# EAGLE board ESP32 Display 2.4 inch V1.2 (EAGLE 9.5.1)
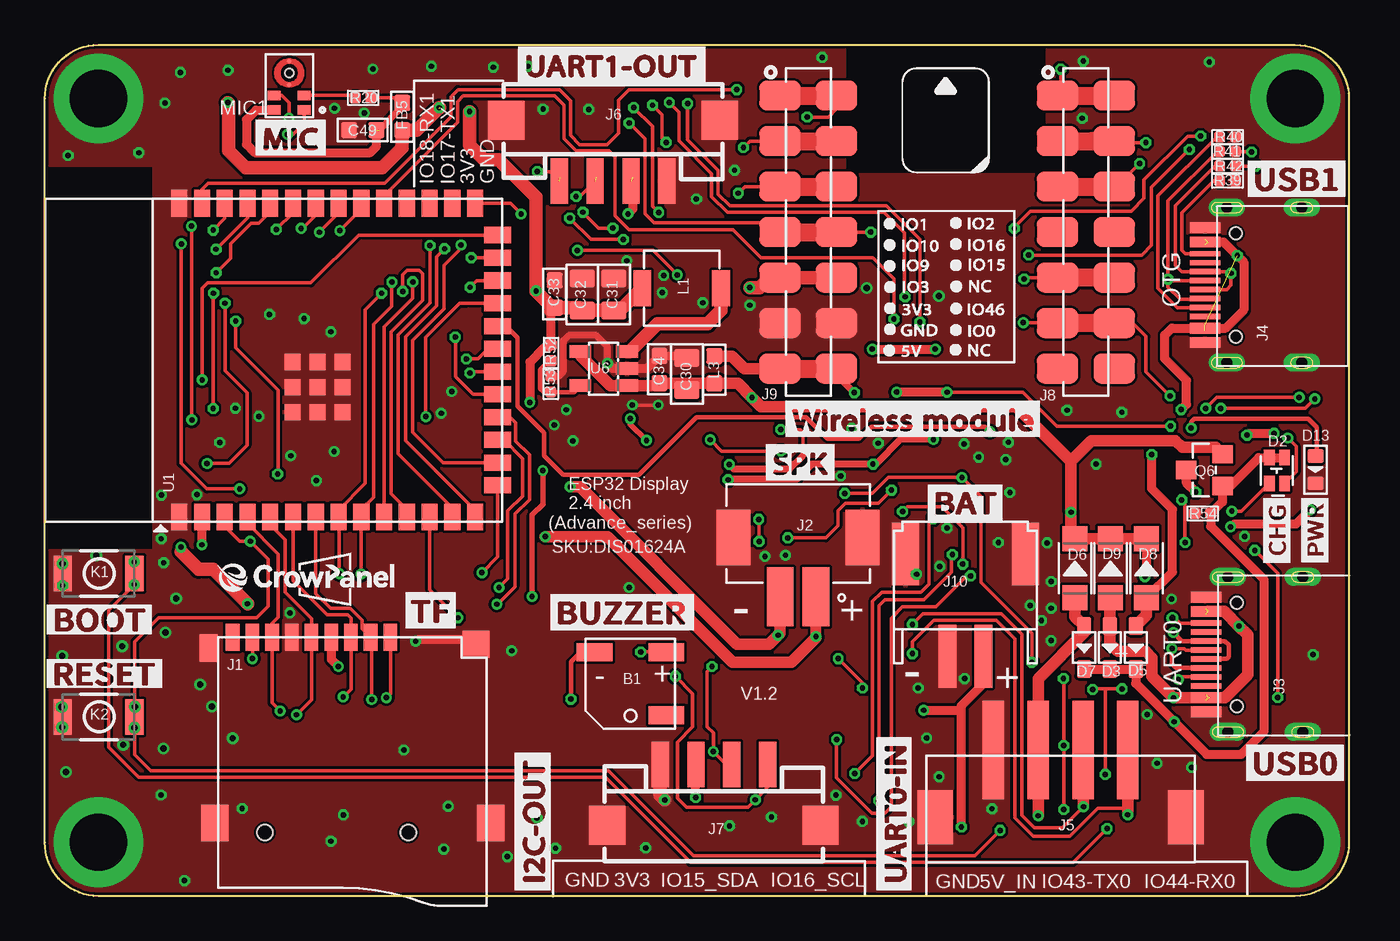
[diagram p5: board, top side]
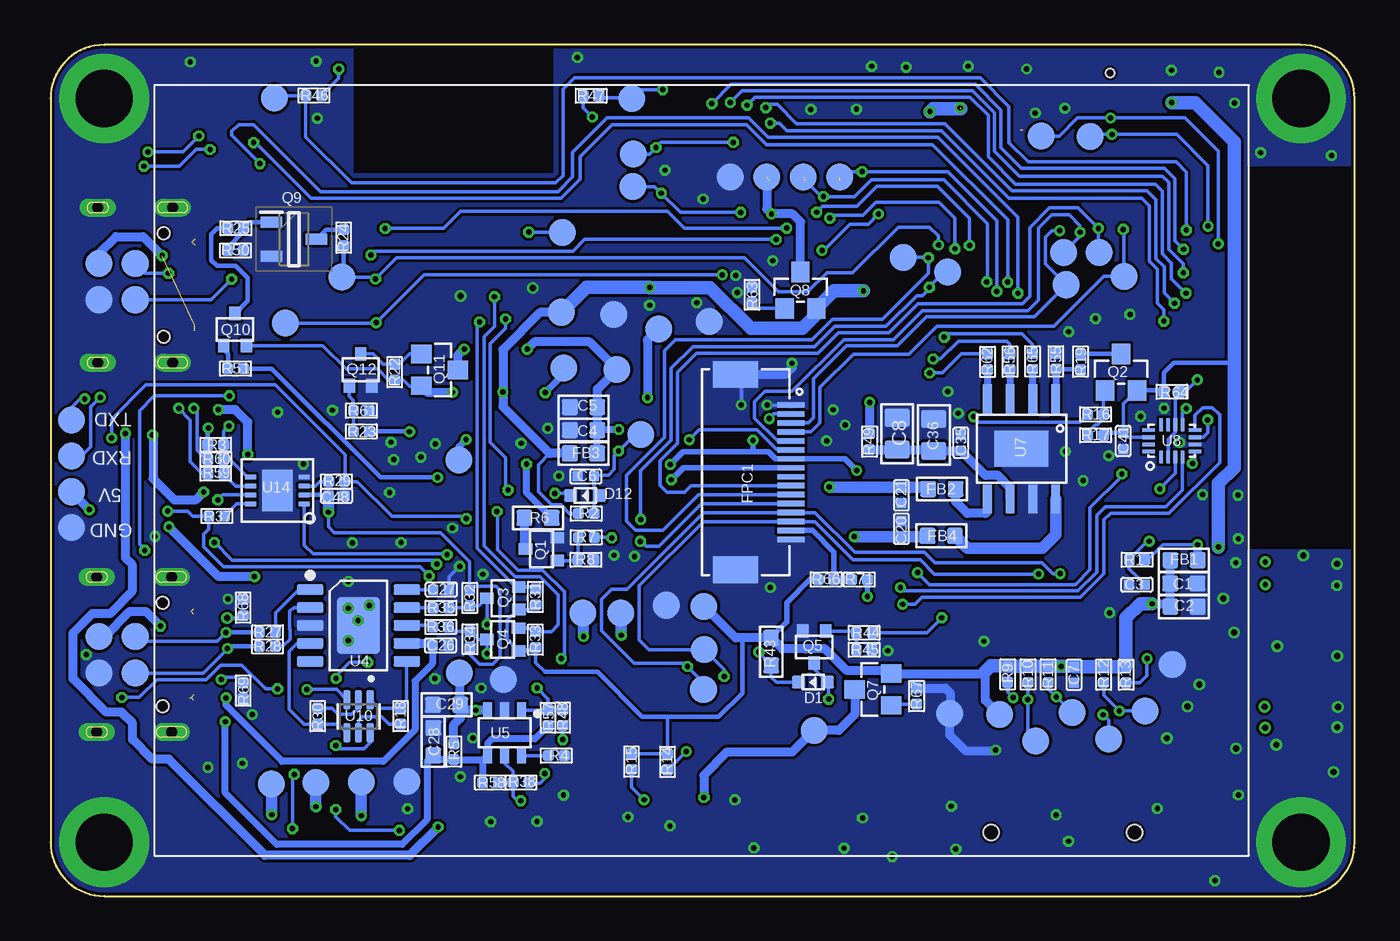
[diagram p6: board, bottom side, seen from below]

Size 72.8 x 47.5 mm. Coordinates in mm from the lower left corner, seen from the top.
Outline: 69.8,0 3,0 arc-90 0,3 0,44.5 arc-90 3,47.5 69.8,47.5 arc-90 72.8,44.5 72.8,3 arc-90 69.8,0
Copper layers (1*16): Top 0.035mm / dielectric 1.5mm / Bottom 0.035mm
Design rules "default": minimum track width 8mil, minimum drill 0.3mm, track to track 6mil, track to pad 6mil, pad to pad 4mil, via to via 6mil, smd to smd 6mil, copper to edge 6mil, drill to drill 4mil, minimum pad ring 6mil, minimum via ring 6mil, stop-mask expansion 4mil, vias tented up to drill 100mil, thermal gap 0mil
tRestrict: area 44.7,40.3 to 55.8,47.4; area 0,19.4 to 6,40.7
bRestrict: area 44.7,40.3 to 55.8,47.4; area 0,19.4 to 6,40.7

## Footprints (pad centres in the part's own frame; a part is rotated, then mirrored left to right if it is on the bottom)
BEEP_5025 = smd 2 x 1: 1 -2,-1.75; 2 2,-1.75; 3 -2,1.75
C0603 = smd 0.889 x 0.889: 1 -0.762,0; 2 0.762,0
C0402 = smd 0.6 x 0.6: 1 -0.45,0; 2 0.45,0
C0805 = smd 1.016 x 1.397: 1 -0.889,0; 2 0.889,0
D_SOD523 = smd 0.762 x 0.7: + -0.8,0; - 0.8,0
LED_KT-0603RYG = smd 0.85 x 0.6: 1 0.725,-0.425; 2 0.725,0.425; 3 -0.725,-0.425; 4 -0.725,0.425
D_SOD323 = smd 1 x 0.8: + -1.2,0; - 1.2,0
D_SOD123FL = smd 1.397 x 1.397: + -1.651,0; - 1.651,0
LED0603 = smd 0.762 x 0.889: + -0.762,0; - 0.762,0
L0603 = smd 0.889 x 0.889: 1 -0.762,0; 2 0.762,0
FPC-0.5MM-16P-SMD = smd 0.3 x 1.5: 1 -3.75,1.55; 2 -3.25,1.55; 3 -2.75,1.55; 4 -2.25,1.55; 5 -1.75,1.55; 6 -1.25,1.55; 7 -0.75,1.55; 8 -0.25,1.55; 9 0.25,1.55; 10 0.75,1.55; 11 1.25,1.55; 12 1.75,1.55; 13 2.25,1.55; 14 2.75,1.55; 15 3.25,1.55; 16 3.75,1.55 | smd 1.5 x 2.5: 17 5.45,-1.55; 18 -5.45,-1.55
9P-SMD-W/-RING = smd 1.524 x 0.762: 1 0,4.4; 2 0,3.3; 3 0,2.2; 4 0,1.1; 5 0,0; 6 0,-1.1; 7 0,-2.2; 8 0,-3.3; 9 0,-4.4 | smd 1.524 x 1.016: G1 0.6,-5.746 | smd 2.032 x 1.524: G2 10.373,-5.4; G3 10.373,10 | smd 1.524 x 1.524: G4 0.392,9.181 | hole 0.889: 10.9,-2.6; 10.9,5.4
CONN-TH_2P-P2.00_XUNPU_WAFER-PH2.0-2PLB = smd 1.5 x 3.3: 1 -1,1.65; 2 1,1.65 | smd 1.9 x 3.1: 3 3.6,-1.65; 4 -3.6,-1.65
USB-3.0TYPEC-SMD = smd 0.3 x 1.7: A1 -3.35,0.5; A4 -2.55,0.5; A5 -1.25,0.5; A6 -0.25,0.5; A7 0.25,0.5; A8 1.25,0.5; A9 2.55,0.5; A12 3.35,0.5; B1 3.05,0.5; B4 2.25,0.5; B5 1.75,0.5; B6 0.75,0.5; B7 -0.75,0.5; B8 -1.75,0.5; B9 -2.25,0.5; B12 -3.05,0.5 | drill 0.6 pad 1.016 long: P$1 -4.325,-0.72; P$2 4.325,-0.72; P$3 -4.325,-4.9; P$4 4.325,-4.9 | hole 0.68: -2.89,-1.22; 2.89,-1.22
XH2.54-4P-SMD = smd 1.2 x 5.5: 1 -3.75,-1.875; 2 -1.25,-1.875; 3 1.25,-1.875; 4 3.75,-1.875 | smd 2 x 3: 5 -7,1.875; 6 7,1.875
CONNECTOR_4P-SMD-2.0 = smd 0.965 x 2.54: 1 -3,0; 2 -1,0; 3 1,0; 4 3,0 | smd 2.032 x 2.184: SS1 -5.946,3.4; SS2 5.946,3.4
H7-2.54-18.28X2.5X5MM = smd 1.65 x 2.3: 1 -7.62,-1.58; 1-1 -7.62,1.58; 2 -5.08,-1.58; 2-2 -5.08,1.58; 3 -2.54,-1.58; 3-3 -2.54,1.58; 4 0,-1.58; 4-4 0,1.58; 5 2.54,-1.58; 5-5 2.54,1.58; 6 5.08,-1.58; 6-6 5.08,1.58; 7 7.62,-1.58; 7-7 7.62,1.58
PH2.0WT-2PIN = smd 1 x 3.5: P$1 -1,0; P$2 1,0 | smd 1.5 x 3.5: P$3 -3.35,-5.7; P$4 3.35,-5.7
TEST-PIN-4-2.0MM = smd 1.5 x 1.5: 1 -3,0; 2 -1,0; 3 1,0; 4 3,0
THO-M3.2*5MM-HOLE = drill 3.2 pad 5: P$1 0,0
157SW = smd 1.016 x 1.981: 1 0,0; 2 4,0
L0420 = smd 2 x 1: 1 0,2.2; 2 0,-2.2
MIC-SMD_5P-L3.5-W2.7-P1.67 = smd 0.725 x 0.522: 1 -0.838,1.362; 2 -0.838,0.542; 3 0.838,0.542; 4 0.838,1.362 | smd 0.25 x 0.25: 5_1 0,-0.048; 5_2 0,-1.373 | hole 0.5: 0,-0.71
TEST_PAD-1.5MM = smd 1.5 x 1.5: P$1 0,0
MOS_SOT323 = smd 0.635 x 0.762: 1 -0.635,-0.889; 2 0.635,-0.889; 3 0,0.889
PMOS_SOT23 = smd 1.016 x 1.143: 1 -0.889,-1.016; 2 0.889,-1.016; 3 0,1.016
SOT95P280X125-3N = smd 1.2 x 0.6: 1 -1.25,0.95; 2 -1.25,-0.95; 3 1.25,0
R0402 = smd 0.635 x 0.635: 1 -0.445,0; 2 0.445,0
R0603-SP = smd 0.889 x 0.889: 1 -0.762,0; 2 0.762,0
ESP32-S3-WROOM-1-SMD41 = smd 1.5 x 0.9: 1 -8.75,5.26; 2 -8.75,3.99; 3 -8.75,2.72; 4 -8.75,1.45; 5 -8.75,0.18; 6 -8.75,-1.09; 7 -8.75,-2.36; 8 -8.75,-3.63; 9 -8.75,-4.9; 10 -8.75,-6.17; 11 -8.75,-7.44; 12 -8.75,-8.71; 13 -8.75,-9.98; 14 -8.75,-11.25; 27 8.75,-11.25; 28 8.75,-9.98; 29 8.75,-8.71; 30 8.75,-7.44; 31 8.75,-6.17; 32 8.75,-4.9; 33 8.75,-3.63; 34 8.75,-2.36; 35 8.75,-1.09; 36 8.75,0.18; 37 8.75,1.45; 38 8.75,2.72; 39 8.75,3.99; 40 8.75,5.26 | smd 0.9 x 1.5: 15 -6.985,-12.5; 16 -5.715,-12.5; 17 -4.445,-12.5; 18 -3.175,-12.5; 19 -1.905,-12.5; 20 -0.635,-12.5; 21 0.635,-12.5; 22 1.905,-12.5; 23 3.175,-12.5; 24 4.445,-12.5; 25 5.715,-12.5; 26 6.985,-12.5 | smd 0.9 x 0.9: 41 -2.9,-1.06; 42 -1.5,-1.06; 43 -0.1,-1.06; 44 -2.9,-2.46; 45 -1.5,-2.46; 46 -0.1,-2.46; 47 -2.9,-3.86; 48 -1.5,-3.86; 49 -0.1,-3.86
ESOP-10-EP-150MIL = smd 1.5 x 0.6: 1 -2.7,2; 2 -2.7,1; 3 -2.7,0; 4 -2.7,-1; 5 -2.7,-2; 6 2.7,-2; 7 2.7,-1; 8 2.7,0; 9 2.7,1; 10 2.7,2 | smd 2.4 x 3.2: EP 0,0
SOT23-6L = smd 0.5 x 0.9: 1 -0.961,-1.212; 2 -0.011,-1.212; 3 0.94,-1.212; 4 0.94,1.288; 5 -0.011,1.288; 6 -0.961,1.288
IC_SOT23-5 = smd 0.69 x 1.2: 1 -0.95,-1.3; 2 0,-1.3; 3 0.95,-1.3; 4 0.95,1.3; 5 -0.95,1.3
NS4168-ESOP-8 = smd 1.6 x 0.5: 1 -2.8,1.905; 2 -2.8,0.635; 3 -2.8,-0.635; 4 -2.8,-1.905; 5 2.8,-1.905; 6 2.8,-0.635; 7 2.8,0.635; 8 2.8,1.905 | smd 2 x 3: 9 0,0
IC_SGM3799_TQFN2.6X1.8_16L = smd 0.2 x 0.7: 1 -0.6,-0.9; 2 -0.2,-0.9; 3 0.2,-0.9; 4 0.6,-0.9; 9 0.6,0.9; 10 0.2,0.9; 11 -0.2,0.9; 12 -0.6,0.9 | smd 0.7 x 0.2: 5 1.3,-0.6; 6 1.3,-0.2; 7 1.3,0.2; 8 1.3,0.6; 13 -1.3,0.6; 14 -1.3,0.2; 15 -1.3,-0.2; 16 -1.3,-0.6
SOP65P210X100-6N = smd 1.09 x 0.4: 1 -0.92,0.65; 2 -0.92,0; 3 -0.92,-0.65; 4 0.92,-0.65; 5 0.92,0; 6 0.92,0.65
DFN8 = smd 0.61 x 0.25: 1 -1.5,0.75; 2 -1.5,0.25; 3 -1.5,-0.25; 4 -1.5,-0.75; 5 1.5,-0.75; 6 1.5,-0.25; 7 1.5,0.25; 8 1.5,0.75 | smd 1.7 x 2.3: P$9 0,0

## Placement (x,y rotation side)
B1  BEEP_5025  [BEEP_5025]  32.69,11.85 180 top
C1  10uF/0603  [C0603]  9.54,17.44 180 bottom
C2  100nF/0603  [C0603]  9.53,16.15 180 bottom
C3  1uF  [C0402]  12.16,17.37 0 bottom
C4  100nF/0603  [C0603]  43.04,26 0 bottom
C5  100nF/0603  [C0603]  43.04,27.28 0 bottom
C6  1uF  [C0402]  42.92,23.42 0 bottom
C7  1uF  [C0402]  15.67,12.35 90 bottom
C8  47uF/0805  [C0805]  25.54,25.8 90 bottom
C20  1nF  [C0402]  25.3,20.49 270 bottom
C21  1nF  [C0402]  25.3,22.36 90 bottom
C26  1uF  [C0402]  51.03,13.98 180 bottom
C27  1uF  [C0402]  50.99,17.1 180 bottom
C28  1uF/0603  [C0603]  51.44,8.62 270 bottom
C29  10uF/0603/NC  [C0603]  50.69,10.67 0 bottom
C30  22uF/0805  [C0805]  35.84,29.13 270 top
C31  22uF/0805  [C0805]  31.77,33.56 270 top
C32  22uF/0805  [C0805]  30,33.56 270 top
C33  1uF/0603  [C0603]  28.46,33.59 270 top
C34  1uF/0603  [C0603]  34.31,29.39 270 top
C35  100nF  [C0402]  21.99,25.3 90 bottom
C36  47uF/0805  [C0805]  23.49,25.73 90 bottom
C41  1uF  [C0402]  12.93,25.39 90 bottom
C48  1uF  [C0402]  56.83,22.33 180 bottom
C49  100nF/0603  [C0603]  17.75,42.74 0 top
D1  B5819WT  [D_SOD523]  30.24,11.94 180 bottom
D2  KT-0603RYG  [LED_KT-0603RYG]  68.77,23.75 90 top
D3  1N5817WS  [D_SOD323]  59.45,13.87 270 top
D5  1N5817WS  [D_SOD323]  60.9,13.87 270 top
D6  DSS34  [D_SOD123FL]  57.51,18.29 90 top
D7  1N5817WS  [D_SOD323]  58.02,13.87 270 top
D8  DSS34  [D_SOD123FL]  61.5,18.29 90 top
D9  DSS34  [D_SOD123FL]  59.49,18.29 90 top
D12  B5819WT  [D_SOD523]  42.96,22.35 180 bottom
D13  Red  [LED0603]  70.93,23.8 270 top
FB1  0R/800mA  [L0603]  9.53,18.74 0 bottom
FB2  1K/500mA  [L0603]  23.04,22.71 180 bottom
FB3  0R/800mA  [L0603]  43.05,24.7 0 bottom
FB4  1K/500mA  [L0603]  23.08,20.1 180 bottom
FB5  0R/800mA  [L0603]  19.95,43.49 90 top
FPC1  TFT-2.4-SPI-16P  [FPC-0.5MM-16P-SMD]  33.01,23.65 270 bottom
J1  [9P-SMD-W/-RING]  14.89,14.44 270 top
J2  WAFER-PH2.0-2PLB  [CONN-TH_2P-P2.00_XUNPU_WAFER-PH2.0-2PLB]  42.05,18.36 180 top
J3  TYPEC-3.0-16P-SMD  [USB-3.0TYPEC-SMD]  65.32,13.48 90 top
J4  TYPEC-3.0-16P-SMD  [USB-3.0TYPEC-SMD]  65.26,34.09 90 top
J5  XH2.54-4P-SMT  [XH2.54-4P-SMD]  56.7,6.28 180 top
J6  HY2.0-4P-SMT  [CONNECTOR_4P-SMD-2.0]  31.72,39.89 0 top
J7  HY2.0-4P-SMT  [CONNECTOR_4P-SMD-2.0]  37.35,7.35 180 top
J8  [H7-2.54-18.28X2.5X5MM]  58.11,37.05 270 top
J9  [H7-2.54-18.28X2.5X5MM]  42.62,37.05 270 top
J10  PH2.0WT-2PIN  [PH2.0WT-2PIN]  51.39,13.38 180 top
J11  HC-PZ200-8.7L-1X4PZ1  [TEST-PIN-4-2.0MM]  71.62,23.56 270 bottom
J12  THO-M3.25MM-HOLE  [THO-M3.2*5MM-HOLE]  3,3 0 top
J13  THO-M3.25MM-HOLE  [THO-M3.2*5MM-HOLE]  69.8,3 0 top
J14  THO-M3.25MM-HOLE  [THO-M3.2*5MM-HOLE]  69.8,44.5 0 top
J15  THO-M3.25MM-HOLE  [THO-M3.2*5MM-HOLE]  3,44.5 0 top
K1  BUTTON  [157SW]  1,18 0 top
K2  BUTTON  [157SW]  1,10 0 top
L1  4.7uH/3A  [L0420]  35.55,33.92 270 top
L3  NC  [L0603]  37.37,29.37 270 top
MIC1  LMD3526B261-OFA01  [MIC-SMD_5P-L3.5-W2.7-P1.67]  13.65,45.22 180 top
P1  TEST_PADPAD-1.5MM  [TEST_PAD-1.5MM]  36.33,16.16 180 bottom
P2  TEST_PADPAD-1.5MM  [TEST_PAD-1.5MM]  36.35,11.51 0 bottom
P3  TEST_PADPAD-1.5MM  [TEST_PAD-1.5MM]  36.31,13.75 0 bottom
P4  TEST_PADPAD-1.5MM  [TEST_PAD-1.5MM]  22.71,34.82 0 bottom
P5  TEST_PADPAD-1.5MM  [TEST_PAD-1.5MM]  25.2,35.64 0 bottom
P6  TEST_PADPAD-1.5MM  [TEST_PAD-1.5MM]  38.43,16.23 180 bottom
P7  TEST_PADPAD-1.5MM  [TEST_PAD-1.5MM]  41.18,29.39 0 bottom
P8  TEST_PADPAD-1.5MM  [TEST_PAD-1.5MM]  39.86,25.75 0 bottom
P9  TEST_PADPAD-1.5MM  [TEST_PAD-1.5MM]  12.88,34.58 180 bottom
P10  TEST_PADPAD-1.5MM  [TEST_PAD-1.5MM]  14.26,35.91 0 bottom
P11  TEST_PADPAD-1.5MM  [TEST_PAD-1.5MM]  16.25,35.9 0 bottom
P12  TEST_PADPAD-1.5MM  [TEST_PAD-1.5MM]  16.1,34.11 0 bottom
P13  TEST_PADPAD-1.5MM  [TEST_PAD-1.5MM]  44.24,37.03 0 bottom
P14  TEST_PADPAD-1.5MM  [TEST_PAD-1.5MM]  40.3,39.59 0 bottom
P15  TEST_PADPAD-1.5MM  [TEST_PAD-1.5MM]  50,24.32 0 bottom
P16  TEST_PADPAD-1.5MM  [TEST_PAD-1.5MM]  30.18,9.25 0 bottom
P17  TEST_PADPAD-1.5MM  [TEST_PAD-1.5MM]  19.83,10.14 0 bottom
P18  TEST_PADPAD-1.5MM  [TEST_PAD-1.5MM]  40.97,15.8 0 bottom
P19  TEST_PADPAD-1.5MM  [TEST_PAD-1.5MM]  17.8,8.66 0 bottom
P20  TEST_PADPAD-1.5MM  [TEST_PAD-1.5MM]  15.77,10.23 0 bottom
P21  TEST_PADPAD-1.5MM  [TEST_PAD-1.5MM]  13.74,8.76 0 bottom
P22  TEST_PADPAD-1.5MM  [TEST_PAD-1.5MM]  11.7,10.33 0 bottom
P23  TEST_PADPAD-1.5MM  [TEST_PAD-1.5MM]  40.28,41.39 0 bottom
P24  TEST_PADPAD-1.5MM  [TEST_PAD-1.5MM]  10.18,12.92 0 bottom
P26  TEST_PADPAD-1.5MM  [TEST_PAD-1.5MM]  14.78,42.37 0 bottom
P27  TEST_PADPAD-1.5MM  [TEST_PAD-1.5MM]  17.52,42.4 0 bottom
P28  TEST_PADPAD-1.5MM  [TEST_PAD-1.5MM]  22.61,10.18 90 bottom
P30  TEST_PADPAD-1.5MM  [TEST_PAD-1.5MM]  43.1,15.79 0 bottom
P31  TEST_PADPAD-1.5MM  [TEST_PAD-1.5MM]  59.69,31.97 180 bottom
P32  TEST_PADPAD-1.5MM  [TEST_PAD-1.5MM]  56.53,34.54 180 bottom
P36  TEST_PADPAD-1.5MM  [TEST_PAD-1.5MM]  32.81,40.11 0 bottom
P37  TEST_PADPAD-1.5MM  [TEST_PAD-1.5MM]  34.85,40.11 0 bottom
P38  TEST_PADPAD-1.5MM  [TEST_PAD-1.5MM]  30.78,40.11 0 bottom
P39  TEST_PADPAD-1.5MM  [TEST_PAD-1.5MM]  28.75,40.11 0 bottom
P40  TEST_PADPAD-1.5MM  [TEST_PAD-1.5MM]  55.45,6.36 0 bottom
P41  TEST_PADPAD-1.5MM  [TEST_PAD-1.5MM]  52.91,6.39 0 bottom
P42  TEST_PADPAD-1.5MM  [TEST_PAD-1.5MM]  57.99,6.33 0 bottom
P43  TEST_PADPAD-1.5MM  [TEST_PAD-1.5MM]  60.47,6.26 0 bottom
P44  TEST_PADPAD-1.5MM  [TEST_PAD-1.5MM]  70.1,35.31 0 bottom
P45  TEST_PADPAD-1.5MM  [TEST_PAD-1.5MM]  68.07,33.27 0 bottom
P46  TEST_PADPAD-1.5MM  [TEST_PAD-1.5MM]  68.07,35.31 0 bottom
P47  TEST_PADPAD-1.5MM  [TEST_PAD-1.5MM]  70.1,33.27 0 bottom
P48  TEST_PADPAD-1.5MM  [TEST_PAD-1.5MM]  70.1,14.48 0 bottom
P49  TEST_PADPAD-1.5MM  [TEST_PAD-1.5MM]  68.07,14.48 0 bottom
P50  TEST_PADPAD-1.5MM  [TEST_PAD-1.5MM]  68.07,12.45 0 bottom
P51  TEST_PADPAD-1.5MM  [TEST_PAD-1.5MM]  70.1,12.45 0 bottom
P52  TEST_PADPAD-1.5MM  [TEST_PAD-1.5MM]  49.99,12.46 0 bottom
P53  TEST_PADPAD-1.5MM  [TEST_PAD-1.5MM]  47.52,12.09 0 bottom
P54  TEST_PADPAD-1.5MM  [TEST_PAD-1.5MM]  38.86,31.65 270 bottom
P55  TEST_PADPAD-1.5MM  [TEST_PAD-1.5MM]  36.04,32.07 270 bottom
P58  TEST_PADPAD-1.5MM  [TEST_PAD-1.5MM]  60.31,44.53 0 bottom
P59  TEST_PADPAD-1.5MM  [TEST_PAD-1.5MM]  40.34,44.5 0 bottom
P60  TEST_PADPAD-1.5MM  [TEST_PAD-1.5MM]  41.36,32.46 0 bottom
P61  TEST_PADPAD-1.5MM  [TEST_PAD-1.5MM]  44.28,32.58 0 bottom
P62  TEST_PADPAD-1.5MM  [TEST_PAD-1.5MM]  44.16,29.47 0 bottom
Q1  SS8050W-SOT323  [MOS_SOT323]  45.39,19.36 90 bottom
Q2  AO3401  [PMOS_SOT23]  13.04,29.23 0 bottom
Q3  BSS138W_SOT323  [MOS_SOT323]  47.55,16.62 90 bottom
Q4  BSS138W_SOT323  [MOS_SOT323]  47.56,14.31 90 bottom
Q5  SS8050W-SOT323  [MOS_SOT323]  30.17,13.9 180 bottom
Q6  AO3401  [PMOS_SOT23]  64.72,23.77 90 top
Q7  AO3401  [PMOS_SOT23]  26.89,11.53 90 bottom
Q8  AO3401  [PMOS_SOT23]  30.93,33.81 0 bottom
Q9  AO3400  [SOT95P280X125-3N]  59.21,36.65 0 bottom
Q10  SS8550W-SOT323  [MOS_SOT323]  62.5,31.61 0 bottom
Q11  AO3401/NC  [PMOS_SOT23]  51.08,29.36 270 bottom
Q12  SS8050W-SOT323/NC  [MOS_SOT323]  55.49,29.36 0 bottom
R1  10K  [R0402]  12.15,18.76 0 bottom
R2  10K  [R0402]  42.9,21.34 180 bottom
R3  5.1K  [R0402]  63.58,25.18 0 bottom
R4  2K  [R0402]  44.57,7.84 180 bottom
R5  5.1K  [R0402]  50.29,8.06 270 bottom
R6  8.2R/0603  [R0603-SP]  45.58,21.1 0 bottom
R7  1K  [R0402]  42.9,20.01 0 bottom
R8  47K  [R0402]  42.92,18.77 0 bottom
R9  10K  [R0402]  19.37,12.37 90 bottom
R10  10K  [R0402]  18.23,12.37 90 bottom
R11  10K  [R0402]  17.11,12.37 90 bottom
R12  10K  [R0402]  14.01,12.36 90 bottom
R13  10K  [R0402]  12.76,12.35 90 bottom
R14  4.7k  [R0402]  38.36,7.49 90 bottom
R15  4.7k  [R0402]  40.37,7.5 90 bottom
R16  100R  [R0402]  14.47,26.88 0 bottom
R17  10K  [R0402]  14.47,25.71 0 bottom
R18  10K  [R0402]  53.26,10.04 90 bottom
R19  1K  [R0402]  15.31,29.82 270 bottom
R20  10K/NC  [R0402]  17.77,44.54 0 top
R22  100K/NC  [R0402]  53.59,29.23 270 bottom
R23  1K/NC  [R0402]  55.45,25.93 0 bottom
R24  100R  [R0402]  56.44,36.75 270 bottom
R25  100R  [R0402]  62.46,37.27 180 bottom
R27  0R  [R0402]  60.69,14.72 180 bottom
R28  0R  [R0402]  60.69,13.93 180 bottom
R29  2K  [R0402]  56.83,23.13 0 bottom
R30  10K  [R0402]  57.89,10.04 270 bottom
R31  4.7k  [R0402]  45.73,16.69 270 bottom
R32  4.7k  [R0402]  49.4,16.64 90 bottom
R33  4.7k  [R0402]  45.73,14.31 270 bottom
R34  4.7k  [R0402]  49.38,14.33 270 bottom
R35  0R  [R0402]  51,16.08 180 bottom
R36  0R  [R0402]  51.02,15.02 180 bottom
R37  5.1K  [R0402]  63.52,21.21 180 bottom
R38  NC  [R0402]  46.54,6.33 0 bottom
R39  5.1K  [R0402]  66.02,39.91 180 top
R40  5.1K  [R0402]  66.02,42.35 180 top
R41  0R  [R0402]  66.02,41.54 180 top
R42  0R  [R0402]  66.02,40.73 180 top
R43  3.9R/0603  [R0603-SP]  32.57,13.64 90 bottom
R44  1K  [R0402]  27.38,14.69 0 bottom
R45  47K  [R0402]  27.39,13.74 0 bottom
R46  0R  [R0402]  58.11,44.67 180 bottom
R47  0R  [R0402]  42.62,44.66 0 bottom
R48  NC  [R0402]  44.22,9.96 270 bottom
R49  0R  [R0402]  27.08,25.36 270 bottom
R50  10K  [R0402]  62.47,36.02 0 bottom
R51  10K  [R0402]  62.47,29.43 180 bottom
R52  45.3K  [R0402]  28.26,30.31 90 top
R53  10K  [R0402]  28.25,28.57 270 top
R54  10K  [R0402]  64.64,21.35 0 top
R55  100K  [R0402]  16.68,29.84 90 bottom
R56  0R  [R0402]  19.24,29.82 90 bottom
R57  5.1K  [R0402]  45.02,9.95 90 bottom
R58  5.1K  [R0402]  48.25,6.33 0 bottom
R59  0R  [R0402]  63.58,23.57 0 bottom
R60  0R  [R0402]  63.58,24.38 0 bottom
R61  47K/NC  [R0402]  55.45,27.09 0 bottom
R62  0R  [R0402]  20.49,29.81 90 bottom
R63  10K  [R0402]  33.64,33.55 270 bottom
R64  10K/NC  [R0402]  10.21,28.14 180 bottom
R65  0R  [R0402]  17.98,29.83 90 bottom
R66  0R/NC  [R0402]  29.51,17.67 180 bottom
R67  10K  [R0402]  24.46,11.16 270 bottom
R68  5.1K  [R0402]  62.05,16.1 270 bottom
R69  5.1K  [R0402]  62.05,11.46 270 bottom
R71  0R  [R0402]  27.65,17.66 0 bottom
U1  ESP32-S3-WROOM-1  [ESP32-S3-WROOM-1-SMD41]  12.77,29.9 90 top
U4  CH340K  [ESOP-10-EP-150MIL]  55.61,15.1 0 bottom
U5  TP4059-SOT23-6  [SOT23-6L]  47.45,9.15 180 bottom
U6  RY3420  [IC_SOT23-5]  31.2,29.43 90 top
U7  NS4168-ESOP-8  [NS4168-ESOP-8]  18.6,24.95 270 bottom
U8  SGM3799  [IC_SGM3799_TQFN2.6X1.8_16L]  10.21,25.4 0 bottom
U10  UMH3NTN  [SOP65P210X100-6N]  55.61,10.03 270 bottom
U14  STC8G1K08A  [DFN8]  60.14,22.63 180 bottom

## Tracks (layer width: path | path; a pad name or v marks a point on that pad's centre or on a via)
3V3  (via drill 0.3)  (1 unrouted)
  Top 0.203: v62.84,26.22 56.49,26.22 54.6,28.11 v50.36,28.11
  Top 0.508: 31.77,32.66 C31.2 | J1.4 15.99,13.21 v16.39,12.81 | 7.6,19.22 v7.6,19.47 | 28.26,32.63 R52.2 28.09,30.59 27.87,30.59 27.08,29.8 v27.08,27.55 | v50.36,28.11 v47.56,28.11 v47.55,28.12
  Top 0.762: 28.26,32.63 C33.2 | C33.2 29.84,32.83 C32.2 C31.2 32.11,32.68 L1.2 | C33.2 28.34,32.83 27.43,33.74 27.43,33.85 | 27.43,34 27.43,33.85 | 27.43,33.85 27.42,33.84 | v27.42,33.77 27.42,33.84 | v39.35,33.96 39.91,33.96 40.46,34.51 J9.5 J9.5-5 | v11.32,16.31 9.4,18.23 8.59,18.23 7.6,19.22 | 27.42,33.84 27.42,38.99 25.33,41.08 24.52,41.08 23.71,41.89 v23.71,43.77 | v10.22,44.28 10.27,44.23 10.27,41.58 11.22,40.63 18.84,40.63 19.95,41.74 FB5.1 20.75,42.73 22,43.98 v22.02,43.98
  Bottom 0.203: 45.2,12.5 45.73,13.03 R33.2 | Q4.1 47.32,14.32 47.32,15.38 46.72,15.98 Q3.1 45.99,15.98 R31.2 | 40.39,7.96 R15.2 R14.2 38.36,10 38.35,10.01 | U8.14 12.68,25.6 C41.2 12.93,27.47 12.18,28.22 Q2.2 | R2.2 43.82,21.34 44.31,21.83 44.84,21.83 45.57,22.56 45.57,24.07 44.94,24.7 | R3.2 63.14,25.92 v62.84,26.22 | R64.2 10.58,28.21 | Q11.2 52.12,28.45 52.75,28.45 53.09,28.79 R22.2 53.93,28.79 54.55,29.41 56.31,29.41 57.62,30.72 Q10.2
  Bottom 0.254: 45.2,12.5 42.26,12.5 39.77,10.01 38.35,10.01 35.5,10.01 34.18,11.33 34.18,14.4 | R33.2 45.92,13.68 Q4.1 | R17.2 13.89,25.84 C41.2 | 12.18,28.22 10.73,28.22 R64.2 10.65,29.19 10.09,29.75 6.73,29.75
  Bottom 0.305: R66.2 30.4,17.67 31.69,16.38 31.69,15.31 32.57,14.43 R43.2
  Bottom 0.508: P17.P$1 20.62,10.92 20.62,12.47 | 19.41,12.86 R9.2 | 20.62,12.47 20.62,12.55 | R10.2 | C7.2 | R12.2 | R13.2 | FB1.1 C1.2 C2.2 10.45,16.31 v11.32,16.31 | 20.62,12.47 20.67,12.42 Q7.2 26.04,12.58 28.34,12.58 29.56,13.8 30.66,13.8 30.67,13.79 31.95,13.79 R43.2 34.18,14.4 34.56,14.4 P1.P$1 | FB3.1 44.94,24.7 47.55,27.31 v47.55,28.12 47.55,30.49 45.46,32.58 P61.P$1 | 6.74,30.45 6.73,30.46 | v27.08,27.55 R49.1 | Q11.2 51.74,28.11 v50.36,28.11
  Bottom 0.762: v27.42,33.77 29.07,33.77 Q8.2 30.04,32.47 30.84,31.67 33.69,31.67 35.98,33.96 v39.35,33.96 39.36,33.97 42.89,33.97 P61.P$1 | 20.62,12.55 20.31,12.86 19.41,12.86 R9.2 R10.2 R11.2 v16.39,12.81 C7.2 | C7.2 R12.2 | R12.2 R13.2 | R13.2 12.76,15.52 11.97,16.31 v11.32,16.31 | v7.6,19.47 7.6,23.04 6.73,23.91 6.73,29.75 6.73,30.46 6.73,42.1 8.91,44.28 v10.22,44.28 | v23.71,43.77 23.55,43.93 21.97,43.93
3V3_1  (1 unrouted)
  Top 0.203: R20.2 19.46,44.54 19.95,44.05
  Top 0.381: 18.65,42.74 19.95,44.05 FB5.2 20.14,44.45
  Top 0.5: 11.77,43.83 11.8,43.86 MIC1.4
  Top 0.508: 11.77,43.83 11.26,43.32 11.26,41.95 11.72,41.49 18.16,41.49 18.51,41.84 C49.2
3V3_OUT1  (via drill 0.3)  (1 unrouted)
  Top 0.508: v32.55,38.06 32.83,38.34 32.83,40.44
  Bottom 0.508: P36.P$1 32.81,38.32 v32.55,38.06 31.39,38.06 30.93,37.61 Q8.3
3V3_OUT2  (via drill 0.3)
  Top 0.508: v36.33,5.51 36.33,7.33 J7.3
  Bottom 0.508: v36.33,5.51 36.33,6.74 35.03,8.04 31.39,8.04 P16.P$1 28.8,9.25 27.91,10.14 Q7.3
+5V_IN  (via drill 0.3)
  Top 0.635: D6.+ 57.51,15.58 D7.+ 58.02,14.71 55.45,12.14 J5.3 v55.45,4.48
  Bottom 0.635: v55.45,4.48 P40.P$1
+VBUS1  (via drill 0.3)  (5 unrouted)
  Top 0.635: D9.+ 59.45,16.59 D3.+ 59.45,14.09 59.89,13.65 61.45,13.65 61.79,13.31 61.79,12.27 v63,11.06 65.04,11.06 | 64.94,15.88 65.84,15.88 v66.66,15.06 67.14,14.58 67.14,12.34 65.86,11.06 64.95,11.06
  Bottom 0.381: C26.2 51.48,12.97 52.45,12 52.45,9.29 54.22,7.52 59.87,7.52 63,10.65 v63,11.06
  Bottom 0.508: U4.7 51.6,14.1 C26.2 | P48.P$1 69.78,14.48 68.37,15.89 67.49,15.89 v66.66,15.06
+VBUS2  (via drill 0.3)  (4 unrouted)
  Top 0.508: 64.91,36.49 65.81,36.49 v66.56,35.73 66.92,35.38 66.92,32.69 65.92,31.7 62.92,31.7 62.52,31.3 62.52,29.99 63.73,28.78 63.73,27.44 v63.43,27.14 | D8.+ 62.94,18.07 62.94,21.58 61.79,22.73 v61.79,24.63
  Top 0.635: D5.+ 61.5,15.67 D8.+
  Bottom 0.508: P44.P$1 70.1,35.84 69.14,36.8 67.63,36.8 v66.56,35.73 | v61.79,24.63 61.79,26.44 62.49,27.14 v63.43,27.14
+VC_IN  (via drill 0.3)
  Top 0.508: D7.- D3.- D5.- 60.9,11.87 v63.05,9.72 64.86,7.91 66.78,7.91 68.07,9.2 68.07,17.64 65.08,20.62 R54.2 65.73,22 65.73,22.8 65.74,22.79 Q6.1 66.17,22.88 67.76,24.47 D2.2 D2.1
  Bottom 0.381: U5.4 48.69,7.57 R58.1 | U5.4 48.65,7.61 R5.2 51.2,7.61 C28.2 51.79,7.51 51.79,4.26 53.16,2.89 60.18,2.89 63.05,5.75 v63.05,9.72 | R57.1 45.76,8.77 48.16,8.77 48.39,8.54 U5.4
C_LED
  Bottom 0.203: U14.8 62.4,21.88 R37.1
CH_EN  (via drill 0.3, 0.35)
  Top 0.203: U1.3 10.05,20.63 10.88,19.8 v11.47,19.8 12.47,18.8 12.47,16.18 11.83,15.54 6.37,15.54 5.03,14.2 5.03,10.59 v5.04,10.57 5,10.53 K2.2 v5.01,9.39 | v55.1,13.04 55.1,14.66 52.25,17.51 52.25,22.31 v51.2,23.36 47.08,23.36 46.19,22.47 v44.65,22.47 | v56.88,8.4 56.88,8.57 | 56.88,8.57 56.88,12.12 v56.86,12.14 | v53.33,3.67 51.92,2.26 36.2,2.26 31.47,6.99 5.91,6.99 5.01,7.89 v5.01,9.39 | v56.88,4.83 56.88,8.57 | 56.88,8.57 | 5.01,9.22 v5.01,9.39
  Bottom 0.203: v11.47,19.8 11.57,19.8 12.28,19.09 12.28,19.08 R1.1 12.6,18.27 12.06,17.74 12.06,17.72 C3.2 | D12.- 43.88,22.47 v44.65,22.47 | U10.6 54.96,8.55 55.3,8.21 56.69,8.21 v56.88,8.4 | v56.86,12.14 56.86,12.29 56.1,13.04 v55.1,13.04 | v56.88,4.83 56.88,4.44 56.11,3.67 v53.33,3.67
  Bottom 0.254: R51.1 60.45,29.43 54.38,23.36 v51.2,23.36
CHRG  (via drill 0.3)
  Top 0.203: v45.64,11.61 45.64,11.9 v44.29,13.25 | v63.65,19.73 63.65,21 63.62,21.02 63.62,21.95 v63.46,22.11 | v51.24,18.52 51.24,20.55 50.07,21.72 48.14,21.72 v47.88,21.46
  Bottom 0.203: U5.1 45.05,10.37 R57.2 | R57.2 R48.1 | R57.2 45.02,10.99 v45.64,11.61 | v44.29,13.25 44.1,13.44 44.1,16.97 45.32,18.19 46.7,18.19 47.85,19.33 47.85,21.43 v47.88,21.46 | U14.7 63.19,22.38 v63.46,22.11 | v63.65,19.73 62.65,18.73 51.45,18.73 v51.24,18.52
D_LED
  Bottom 0.203: R29.1 57.79,23.13 58.04,22.88 U14.3
DA1  (via drill 0.3)
  Top 0.203: v11.59,13.25 J1.8
  Bottom 0.203: R13.1 11.98,11.9 11.59,12.3 v11.59,13.25
DA2  (via drill 0.3)
  Top 0.203: v19.07,11.07 19.29,11.3 J1.1
  Bottom 0.203: R9.1 19.37,11.38 v19.07,11.07
DONE  (via drill 0.3)
  Top 0.203: v50.66,19.05 50.6,18.99 50.6,18.06 49.08,16.54 46.89,16.54 46.56,16.21 v46.56,5.33 v46.55,5.32
  Bottom 0.203: U5.5 47.44,7.41 46.98,6.95 R38.1 | R38.1 R58.2 | U14.1 58.64,19.58 58.15,19.09 50.7,19.09 v50.66,19.05 | v46.55,5.32 46.73,5.32 46.98,5.57 R38.1
DTR
  Bottom 0.203: U10.4 56.74,9.6 R30.2 58.64,9.6 59.47,10.43 59.47,13.66 59.03,14.1 U4.4
ESP_3V3  (via drill 0.3)
  Top 0.508: v8.77,19.6 U1.2
  Bottom 0.203: v8.77,19.6 10.71,19.6 11.55,18.76 R1.2
  Bottom 0.508: FB1.2 v8.77,19.6
ESP_D+  (via drill 0.3)
  Top 0.203: v22.32,36.12 21.87,35.67 21.87,32.93 20.14,31.2 20.14,25.4 24.02,21.52 U1.14 | v29.3,37.83 30.49,36.64 v32.3,36.64 | v54.92,35.77 61.23,35.77 61.77,36.31 61.77,39.54 v63.89,41.66 | v67.58,40.72 66.47,40.72 R42.1
  Bottom 0.203: v22.32,36.12 22.32,37.82 23.21,38.72 26.72,38.72 27.46,37.98 29.12,37.98 29.27,37.83 v29.3,37.83 | v32.3,36.64 42.99,36.64 43.63,35.99 54.7,35.99 v54.92,35.77 | v63.89,41.66 64.67,41.66 65.61,40.72 v67.58,40.72
ESP_D-  (via drill 0.3)
  Top 0.203: v21.5,36.3 21.5,33.1 19.71,31.31 19.71,24.69 22.75,21.65 U1.13 | R41.1 67.34,41.54 v67.36,41.52 | v64.52,42.41 63.8,42.41 61.36,39.97 61.36,38.93 60.64,38.21 55.01,38.21 54.12,37.32 v54.12,37.25 | v31.71,37.27 30.9,37.27 30.04,38.13 v30.04,38.16
  Bottom 0.203: v67.36,41.52 65.39,41.52 64.52,42.39 v64.52,42.41 | v54.12,37.25 50.86,37.25 49.9,38.21 38.36,38.21 37.42,37.27 v31.71,37.27 | v30.04,38.16 29.72,38.48 27.79,38.48 26.67,39.6 23.29,39.6 21.5,37.81 v21.5,36.3
ESP_RXD0  (via drill 0.3)
  Top 0.203: v34.86,44.28 35.39,43.75 35.39,42.15 37.22,40.32 37.22,39.03 38.1,38.15 46.84,38.15 47.99,37.01 47.99,33.47 v48.02,33.44 | U1.36 12.59,38.18 11.95,37.54 11.51,37.54 10.37,36.4 10.37,35.58 v9.57,34.78
  Bottom 0.203: Q4.2 45.92,14.95 R33.1 44.84,14.76 44.46,15.13 44.46,16.82 45.47,17.83 46.88,17.83 48.61,19.56 48.61,31.21 48.02,31.8 v48.02,33.44 | v9.57,34.78 9.57,35.28 10.39,36.1 10.39,39.82 10.74,40.17 18.71,40.17 20.11,41.57 20.11,43.71 21.33,44.94 34.2,44.94 v34.86,44.28
ESP_RXD1  (via drill 0.3)  (1 unrouted)
  Top 0.203: U1.11 20.21,21.58 19.33,22.46 19.33,31.48 21.09,33.24 21.09,34.73 20.9,34.92 20.23,34.92 19.98,34.67 v19.98,33.74 | v27.5,40.42 28.19,40.42 J6.1
  Bottom 0.203: v19.98,33.74 19.98,37.68 22.72,40.42 v27.5,40.42 28.31,40.42
ESP_TXD0  (via drill 0.3)
  Top 0.203: U1.37 11.32,37.85 v9.56,36.09 | v35.88,44.22 35.88,42.21 37.58,40.51 37.58,39.17 38.24,38.51 46.99,38.51 48.85,36.65 v48.85,32.03
  Bottom 0.203: R31.1 45.85,17.25 Q3.2 46.84,17.25 48.99,19.41 48.99,31.89 v48.85,32.03 | v9.56,36.09 10.03,36.56 10.03,40.02 10.62,40.61 18.61,40.61 19.75,41.75 19.75,43.86 21.18,45.29 34.81,45.29 v35.88,44.22
ESP_TXD1  (via drill 0.3)  (1 unrouted)
  Top 0.203: v20.54,34.27 20.54,33.36 18.94,31.76 U1.10 | J6.2 29.87,39.04 v29.66,39.04
  Bottom 0.203: P38.P$1 30.81,40.09 29.75,39.03 27.92,39.03 26.99,39.96 22.94,39.96 20.5,37.52 20.5,34.33 | 20.5,34.27 20.5,34.33 | 20.5,34.33 20.54,34.29 v20.54,34.27
GND  (via drill 0.3, 0.35)
  Top 0.203: v32.8,27.4 v34.24,27.4
  Top 0.381: R53.1 28.7,29.02 28.95,29.26 28.95,30.99 29.25,31.29 30.77,31.29 31.4,30.66 31.4,29.74 v31.41,29.73
  Top 0.508: C30.1 35.71,30.15 C34.1 33.59,29.43 U6.2 31.71,29.43 v31.41,29.73 | v20.7,14.22 20.77,14.29 23.83,14.29 J1.G4
  Top 0.762: J7.4 34.35,5.62 v34.6,5.37
  Bottom 0.203: C27.1 50.54,17.82 v49.96,18.4 | FPC1.1 v32.8,27.4 | v34.24,27.4 34.24,28.84 33.83,29.25 34.46,29.12 FPC1.18
  Bottom 0.254: C6.1 43.39,23.44
  Bottom 0.508: R67.1 22.86,11.6 22.58,11.33 22.58,10.21 P28.P$1 22.61,9 21.73,8.12 20.07,8.12 v20.04,8.15 | v31.41,29.73 31.41,29.47 31.79,29.09 34.43,29.09 34.46,29.12
  other vias: 18.31,46.15 9.77,25.31 10.64,27.22 11.95,26.77 12.55,32.46 14.48,32.22 15.97,31.49 66.97,20.07 53.87,22.52 53.23,19.73 55.95,19.71 53.64,24.35 52.13,24.49 51.32,25.23 53.79,25.32 55.63,15.38 56.18,17.55 34.55,34.63 36.73,33.11 36.37,38.9 38.5,40.5 34.47,33.67 1.3,41.32 5.25,41.48 6.71,44.25 7.57,45.96 10.23,46.08 44.43,23.44 46.53,25.27 45.04,26.1 39.36,32.97 13.68,15.8 8.49,22.4 6.51,22.37 6.5,19.94 6.64,18.6 15.16,23.18 58.68,24.1 60.12,27 57.06,27.11 48.66,17.96 50.36,20.54 52.87,4.87 62.09,7.41 64.01,7.18 70.8,13.47 21.58,46.3 25.04,46.25 26.97,46.3 27.81,43.91 30.36,43.9 48.76,11.61 49.23,8.82 49.92,6.66 11.02,4.89 16.67,4.53 15.98,3.06 22.52,5.01 22.27,2.62 27.47,4.36 33.54,2.69 25.82,2.2 28.51,2.67 38.22,3.92 40.56,4.41 44.16,5.63 45.64,4.17 48.23,4.15 51.34,12.13 55,16.22 56.18,16.06 56.17,14.25 61.54,10.13 32.49,35.45 22.13,26.94 22.71,28.15 28.44,26.29 29.48,25.4 29.11,27.14 26.06,13.69 32.62,17.21 13.73,24.57 16.15,24.81 45.88,33.93 49.91,33.48 8.68,11.81 9.33,10.58 10.49,8.81 41.34,19.02 40.2,18.96 16.17,43.96 17.83,43.7 1,17.33 6.49,5.64 0.97,13.4 6.74,14.7 6.62,8.23 1.19,6.92 0.94,10.55 0.98,9.42 7.34,16.61 0.99,18.54 2.87,19.01 4.32,13.94 4.38,8.44 57.97,46.59 57.91,43.4 62.9,16.58 7.8,0.86 43.39,46.8 65,46.54
  pour Bottom (rank 2): -2,48 -2,-2 74,-2 74,48
  pour Top (rank 2): -2,48 -2,-2 74,-2 74,48
IO0_W_CS  (via drill 0.3)
  Top 0.203: v26.59,38.06 25.99,38.66 U1.27 | v29.73,36.03 33.94,36.03 v35.31,34.66 | v54.62,32 56.5,32 J8.6 | v58.49,11.53 58.52,11.56 59.19,11.56 | 59.19,11.56 v60.13,11.56 | v68.82,11.08 68.82,18.01 v67.54,19.29 | v62.81,27.91 61.47,29.25 61.47,31.22 60.73,31.97 P31.P$1 | v59.29,3.76 57.41,1.88 36.04,1.88 31.29,6.63 5.25,6.63 3.57,8.31 3.57,15.96 v4.99,17.38 v5,17.39 K1.2 v4.99,18.65 | v59.19,6.79 59.19,11.56
  Top 1.016: P31.P$1 J8.6
  Bottom 0.203: v26.59,38.06 27.15,37.5 28.18,37.5 29.69,35.99 v29.73,36.03 | v35.31,34.66 51.96,34.66 v54.62,32 54.65,31.97 P31.P$1 | U10.3 56.84,11.53 v58.49,11.53 | v60.13,11.56 60.8,11.56 62.13,12.89 63.3,12.89 64.12,12.07 66.85,12.07 67.84,11.08 v68.82,11.08 | v67.54,19.29 67.54,19.34 67.83,19.63 67.83,27.09 67.01,27.91 v62.81,27.91 | v59.29,3.76 59.29,6.69 v59.19,6.79
IO1_ESP_TXD2  (via drill 0.3)
  Top 0.203: U1.39 8.78,39.45 9.11,39.78 18.96,39.78 22.67,43.49 22.67,44.61 23.06,45 28.73,45 29.35,44.38 29.35,42.44 29.85,41.94 31.4,41.94 32.02,42.56 32.02,44.42 32.6,45 v38.62,45
  Bottom 0.203: v38.62,45 39.84,45 40.29,44.55 | 40.29,44.55 P59.P$1 | R47.2 42.07,44.55 40.29,44.55
IO2_ESP_RXD2  (via drill 0.3)
  Top 0.203: U1.38 10.05,37.81 v9.4,37.16
  Bottom 0.203: v9.4,37.16 9.4,40.4 9.96,40.96 18.22,40.96 19.29,42.04 19.29,44.05 20.89,45.65 43.56,45.65 44.19,45.02 44.19,40.2 44.6,39.79 55.99,39.79 58.55,42.35 R46.2 60.17,44.67 P58.P$1
IO3_W_MOSI  (via drill 0.3)
  Top 0.203: v13,23.55 13.02,23.57 13.02,28.22 10.66,30.58 v10.66,32.08 | J9.4 40.53,37.56 34.01,37.56 33.5,38.07 33.5,42.26 v32.63,43.13 v32.62,43.13 | v46.11,37.05 J9.4-4 | U1.15 25.27,18.92 v24.4,18.05
  Top 1.016: J9.4 J9.4-4
  Bottom 0.203: v10.66,32.08 10.66,32.72 11.01,33.07 11.01,34.98 11.45,35.42 11.45,38.51 11.88,38.94 19.31,38.94 23.06,42.69 31.69,42.69 32.12,43.12 v32.61,43.12 v32.62,43.13 | P13.P$1 44.26,37.05 v46.11,37.05 | v24.4,18.05 23.73,17.38 15.6,17.38 14.78,18.2 14.78,21.66 13,23.44 v13,23.55
IO4_SD_MISO  (via drill 0.3)
  Top 0.203: v13.14,10.33 12.69,10.78 J1.7 12.69,15.21 13.03,15.55 13.03,19.08 11.32,20.79 U1.4
  Bottom 0.203: R12.1 14.01,11.2 v13.14,10.33 P22.P$1
IO5_SD_SCK  (via drill 0.3)
  Top 0.203: v14.05,10.12 14.89,10.96 J1.5 14.89,15.47 13.42,16.94 13.42,19.88 12.59,20.71 U1.5
  Bottom 0.203: v14.05,10.12 13.74,9.81 P21.P$1
IO6_SD_MOSI  (via drill 0.3)
  Top 0.203: v16.65,11.12 17.09,11.55 17.09,14.15 J1.3 17.09,15.51 16.9,15.7 15.76,15.7 13.86,17.6 U1.6
  Bottom 0.203: P20.P$1 v16.65,11.12 17.11,11.58 R11.1
IO7_SD_CS  (via drill 0.3)
  Top 0.203: v18.25,10.97 18.25,14.38 J1.2 17.73,14.9 17.73,15.38 17.05,16.06 15.95,16.06 15.13,16.88 U1.7
  Bottom 0.203: P19.P$1 18.25,9.11 v18.25,10.97 18.23,10.99 R10.1
IO8_BEEP  (via drill 0.3)
  Top 0.203: v23.05,15.53 21.48,17.1 U1.12
  Bottom 0.203: R44.2 23.89,14.69 v23.05,15.53
IO9  (via drill 0.3)
  Top 0.203: v25.36,17.22 25.84,17.7 25.84,21.49 26.67,22.32 26.67,24.41 25.62,25.45 U1.17
  Bottom 0.203: U8.4 9.61,22.65 10.55,21.71 13.92,21.71 14.39,21.24 14.39,18.08 15.45,17.02 25.16,17.02 v25.36,17.22
IO9_MIC_CLK  (via drill 0.3)
  Top 0.203: v10.88,22.72 9.04,22.72 7.61,24.15 v7.61,36.38 v7.62,36.39 | v13.63,43.42 13.63,44.26 13.21,44.68 MIC1.3
  Bottom 0.203: U8.3 10.01,23.59 v10.88,22.72 | v7.62,36.39 7.62,41.55 9.49,43.42 v13.63,43.42 15.47,43.42 16.48,42.4 P27.P$1
IO9_W_MISO  (via drill 0.3)
  Top 0.203: v38.71,39.22 39.08,39.59 J9.3 | v9.06,24.14 10.29,24.14 11.29,25.14 11.29,28.08 10.06,29.31 v10.06,33.08 | v32.87,44 33.92,42.95 33.92,38.5 v34.27,38.15
  Top 1.016: J9.3 J9.3-3
  Bottom 0.203: U8.5 8.91,24.28 v9.06,24.14 | P14.P$1 39.08,39.59 v38.71,39.22 37.64,38.15 v34.27,38.15 | v10.06,33.08 10.64,33.66 10.64,35.11 11.1,35.57 11.1,38.85 11.61,39.36 19.14,39.36 22.88,43.1 31.15,43.1 32.23,44.18 32.69,44.18 v32.87,44
IO10  (via drill 0.3)
  Top 0.203: v25.23,16.28 25.28,16.28 26.25,17.25 26.25,21.32 27.05,22.12 27.05,24.62 26.29,25.38 26.29,26.41 25.97,26.73 U1.18
  Bottom 0.203: v25.23,16.28 24.54,16.28 24.15,16.67 15.3,16.67 13.99,17.98 13.99,20.99 13.63,21.35 10.37,21.35 7.53,24.19 7.53,26.85 7.94,27.26 8.47,27.26 8.91,26.82 U8.8
IO10_MIC_SD  (via drill 0.3)
  Top 0.203: v8.19,37.38 8.21,37.36 v8.21,26.57 | MIC1.1 14.49,43.14 13.85,42.5 v13.55,42.5
  Bottom 0.203: U8.7 8.45,25.6 8.21,25.84 v8.21,26.57 | v8.19,37.38 8.19,40.75 9.94,42.5 v13.55,42.5 14.65,42.5 P26.P$1
IO10_W_CLK  (via drill 0.3)
  Top 0.203: J9.2 39.36,42.13 v39,41.77 | v9.4,27.21 9.4,33.62 v9.42,33.64 | v33.92,44.13 34.46,43.59 34.46,42.28 v34.69,42.05
  Top 1.016: J9.2 J9.2-2
  Bottom 0.203: U8.9 9.61,27 v9.4,27.21 | P23.P$1 39.38,41.4 v39,41.77 38.72,42.05 v34.69,42.05 | v9.42,33.64 10.23,34.45 10.23,35.32 10.74,35.83 10.74,39.34 11.12,39.72 18.94,39.72 20.46,41.24 20.46,43.56 21.48,44.58 33.47,44.58 v33.92,44.13
IO11_I2S_LRCLK  (via drill 0.3)
  Top 0.203: v22.91,31.19 22.94,31.16 22.94,28.97 23.91,28 U1.19
  Bottom 0.203: v22.91,31.19 22.71,31.39 18.57,31.39 17.98,30.8 R65.2
IO12_I2S_SDIN  (via drill 0.3)
  Top 0.203: U1.20 23.8,29.27 v23.73,29.19
  Bottom 0.203: v23.73,29.19 23.01,29.19 21.95,30.25 R62.2
IO13_I2S_BCLK  (via drill 0.3)
  Top 0.203: v23.53,29.97 24.18,29.97 24.74,30.54 U1.21
  Bottom 0.203: v23.53,29.97 23.12,29.97 22.12,30.97 19.42,30.97 19.24,30.79 R56.2
IO14_TFT_PWR  (via drill 0.3)
  Top 0.254: v52.76,25.91 52.47,26.2 46.14,26.2 45.46,25.52 43.69,25.52 42.5,26.71 36.38,26.71 33.17,23.5 28.93,23.5 27.86,24.57 27.86,25.86 26.4,27.32 26.4,31.15 25.75,31.8 U1.22
  Bottom 0.254: R23.2 52.78,25.93 v52.76,25.91
IO15_SDA  (via drill 0.3)
  Top 0.203: v16.44,17.99 16.44,21.11 U1.8 16.4,21.54 17.89,23.03 17.89,32.73 v18.8,33.64 | J7.2 38.03,7.35 v37.31,8.06 37.31,9.1 36.96,9.45 36.96,12.53 v37.24,12.81 | J8.3-3 59.82,39.59 60.68,40.45 60.69,40.45 v61.11,40.87
  Top 1.016: J8.3 J8.3-3
  Bottom 0.203: v16.44,17.99 16.86,17.99 17.47,18.6 23.43,18.6 24,19.18 27.9,19.18 30.12,21.4 FPC1.13 36.35,21.4 40.63,17.12 41.48,17.12 42.04,16.56 42.04,14.8 40.22,12.98 37.42,12.98 v37.24,12.81 36.35,11.91 P2.P$1 | v61.11,40.87 62.69,42.45 62.69,42.67 62.31,43.05 61.47,43.05 57.73,39.31 44.47,39.31 43.66,40.13 43.66,41.52 41.75,43.43 33.83,43.43 32.74,42.34 23.27,42.34 18.8,37.87 v18.8,33.64 | R14.1 38.04,7.36 38.03,7.36 37.33,8.06 v37.31,8.06
IO16_SCL  (via drill 0.3)
  Top 0.203: v17.65,17.97 17.65,21.13 U1.9 17.67,21.58 18.35,22.26 18.35,31.9 19.37,32.92 v19.37,34.26 | J7.1 40.35,6.06 v39.66,5.38 39.24,4.95 35.82,4.95 35.32,5.45 35.32,8.59 36.16,9.44 36.16,11.3 v35.2,12.26 | v61.46,42.04 59.78,42.04 J8.2-2
  Top 1.016: J8.2 58.44,42.13 J8.2-2
  Bottom 0.203: v35.2,12.26 35.2,12.65 P3.P$1 39.4,13.75 39.94,14.29 39.94,17.31 36.35,20.9 FPC1.14 30.14,20.9 28,18.75 24.25,18.75 23.47,17.97 v17.65,17.97 | v19.37,34.26 19.37,37.74 23.56,41.93 32.84,41.93 33.94,43.03 41.46,43.03 43.25,41.24 43.25,39.99 44.31,38.93 58.24,38.93 61.35,42.04 v61.46,42.04 | R15.1 40.37,6.08 v39.66,5.38
IO21_NS_CTRL  (via drill 0.3)
  Top 0.203: U1.23 23.49,33.08 23.16,33.08 21.27,31.18 v21.27,26.75
  Bottom 0.203: R16.1 15.34,26.45 20.96,26.45 v21.27,26.75
IO38_LED_BK  (via drill 0.3)
  Top 0.203: U1.31 18.94,39.09 23.04,43.19 23.04,44.33 23.35,44.64 28.46,44.64 28.99,44.11 28.99,42.25 29.66,41.58 31.49,41.58 31.83,41.24 31.83,37.97 32.62,37.18 38.42,37.18 39.98,35.62 46.23,35.62 47.4,34.45 v47.4,32.2 | v47.26,22.65 46.52,21.91 44.69,21.91 44.27,21.49 44.27,20.65 43.6,19.98 v41.48,19.98 v41.47,19.99
  Bottom 0.203: v47.26,22.65 47.41,22.8 47.41,24.47 48.25,25.31 48.25,30.82 47.4,31.67 v47.4,32.2 | v41.47,19.99 41.49,20.01 R7.2
IO39_TFT_SDA  (via drill 0.3)
  Top 0.203: v16.47,37.13 17.67,38.33 U1.32
  Bottom 0.203: v16.47,37.13 16.91,37.13 17.28,36.76 17.28,35.29 P12.P$1 17.89,32.32 23.9,32.32 25.53,30.69 28.37,30.69 30.2,28.86 30.2,26.7 30.5,26.4 FPC1.3
IO40_TFT_CS  (via drill 0.3)
  Top 0.203: v15.33,37.04 15.33,37.06 16.4,38.13 U1.33
  Bottom 0.203: P11.P$1 15.33,36.82 v15.33,37.04 15.33,37.4 15.94,38.01 16.91,38.01 17.66,37.26 17.66,33.26 18.25,32.67 24.13,32.67 25.75,31.05 28.52,31.05 31.41,28.16 32.91,28.16 33.5,27.57 33.5,26.67 32.23,25.4 FPC1.5
IO41_TFT_RS  (via drill 0.3)
  Top 0.203: U1.34 15.13,38 14.39,37.26 v14.31,37.26
  Bottom 0.203: P10.P$1 14.3,35.95 14.3,36.75 14.31,36.76 v14.31,37.26 15.45,38.4 17.03,38.4 18.14,37.3 18.14,33.47 18.56,33.05 24.38,33.05 26,31.43 28.81,31.43 29.95,30.29 36.73,30.29 37.8,29.22 37.8,25.28 38.78,24.3 38.78,22.93 38.39,22.54 37.4,22.54 37.04,22.9 FPC1.10
IO42_TFT_SCK  (via drill 0.3)
  Top 0.203: U1.35 13.86,38.14 v12.92,37.2
  Bottom 0.203: v12.92,37.2 12.88,37.16 P9.P$1 14,34.58 16.78,31.8 23.32,31.8 24.88,30.24 27.99,30.24 29.84,28.39 29.84,26.42 30.36,25.9 FPC1.4
IO45_SPISW_ITCHING  (via drill 0.3)
  Top 0.203: U1.26 17.52,36.88 14.85,34.22 9.08,34.22 8.79,33.92 v8.79,28.8
  Bottom 0.203: U8.2 10.41,25.48 10.01,25.88 U8.10 10.01,27.81 9.76,28.06 R64.1 9.45,28.14 v8.79,28.8
IO46_BOOT_BUSY  (via drill 0.3)
  Top 0.203: v54.66,34.43 54.74,34.51 J8.5 | v23.23,36.33 23.23,36.14 22.28,35.19 22.28,32.77 20.53,31.02 20.53,25.89 22.23,24.18 U1.16
  Top 1.016: J8.5-5 J8.5
  Bottom 0.203: v54.66,34.43 v54.66,34.44 | v54.66,34.44 54.77,34.54 P32.P$1 | v54.66,34.44 53.49,35.61 34.05,35.61 32.17,33.73 30.51,33.73 30.51,33.74 29.47,34.78 28.02,34.78 25.48,37.33 23.73,37.33 23.23,36.83 v23.23,36.33
  Bottom 0.254: R24.2 56.44,34.63 P32.P$1
IO47_TP_INT  (via drill 0.3)
  Top 0.203: U1.24 24.11,34.34 v23.74,33.97 | v39.85,21.02 39.85,19.81 v39.87,19.79
  Bottom 0.203: v39.87,19.79 39.83,19.79 39.57,19.53 38.84,19.53 36.47,21.9 FPC1.12 | v39.85,21.02 v39.86,21.03 39.86,23.74 38.15,25.45 38.15,29.45 36.95,30.65 30.15,30.65 29.02,31.79 26.16,31.79 24.45,33.5 24.12,33.5 23.74,33.88 v23.74,33.97 23.74,33.99 22.91,34.82 P4.P$1
IO48_TP_RST  (via drill 0.3)
  Top 0.203: U1.25 v23.8,35.62
  Bottom 0.203: P5.P$1 23.82,35.64 v23.8,35.62 23.8,34.76 26.38,32.19 29.15,32.19 30.3,31.04 37.91,31.04 38.53,30.42 38.53,25.59 40.65,23.47 40.65,20.91 40.15,20.41 38.62,20.41 36.62,22.4 FPC1.11
IOT_5V  (via drill 0.3)
  Top 0.381: v45.19,28.09 44.2,29.08 J9.7-7
  Top 0.635: L3.1 38.36,30.13 39.06,29.43 J9.7
  Top 1.016: J9.7 J9.7-7
  Bottom 0.381: P62.P$1 44.16,29.12 v45.19,28.09
LED_K  (via drill 0.3)
  Top 0.381: v38.14,23.23 38.18,23.27 42,23.27 42.83,24.1 v46.23,24.1 46.39,24.1 47.77,25.48 v49.6,25.48
  Bottom 0.305: v38.14,23.23 37.47,23.9 FPC1.8
  Bottom 0.381: R6.2 46.23,22.51 v46.23,24.1 | P15.P$1 50,25.08 v49.6,25.48
N$1
  Bottom 0.508: Q1.3 46.34,19.41 R6.1
N$2  (via drill 0.3)
  Top 0.254: v63.99,26.12 63.99,26.46 64.16,26.63 70.52,26.63 70.99,26.16 70.99,24.62 D13.+
  Bottom 0.254: R3.1 64.03,26.09 v63.99,26.12
N$3
  Bottom 0.203: R7.1 43.36,20 R8.1 43.41,18.72 Q1.1
N$4
  Bottom 0.203: U14.6 62.45,22.88 R59.2
N$5
  Bottom 0.203: U14.5 61.79,23.38 62.78,24.38 R60.2
N$6
  Bottom 0.635: FB4.1 21.63,19.41 17.45,19.41 16.7,20.16 U7.8
N$7
  Bottom 0.508: U7.5 20.5,21.44 20.6,21.35 21.63,21.35 22.27,21.99 FB2.1
N$8
  Top 0.203: MIC1.2 17.11,44.68 17.25,44.54 R20.1
N$9
  Bottom 0.203: R17.1 14.91,25.87 14.49,26.3 14.36,26.3 14.02,26.63 R16.2 14.02,28.12 Q2.1
N$10
  Bottom 0.203: R4.2 46.47,7.84 U5.6
N$11
  Bottom 0.305: R66.1 29.07,19.19 30.28,20.4 FPC1.15
  Bottom 0.508: R66.1 R71.1
N$12
  Bottom 0.203: R23.1 R61.1 55.9,27.67 56.12,27.89 Q12.1
N$13
  Bottom 0.254: Q9.1 61.68,37.6 R25.1 62.02,37.08 62.91,36.19 R50.1
N$14
  Bottom 0.203: U4.1 58.95,17.1 60.24,15.81 R27.1
N$15
  Bottom 0.203: R28.1 59.83,13.93 59.42,14.34 59.42,14.9 59.44,14.92 59.44,15.89 59.23,16.1 U4.2
N$16
  Top 0.762: U6.3 32.65,30.38 34.2,31.93 36.99,31.93 37.75,32.68 L1.1
N$17
  Bottom 0.203: U10.2 55.61,10.52 55.98,10.15 56.75,10.15 57.08,10.48 R30.1
N$18
  Bottom 0.203: U10.5 55.61,9.81 55.41,10.01 54.32,10.01 53.91,9.6 R18.1
N$19
  Bottom 0.203: Q8.1 33.33,32.79 R63.2
N$20
  Bottom 0.203: U4.10 C27.2
N$21
  Bottom 0.203: R67.2 25.8,10.72 Q7.1
N$22
  Bottom 0.203: U4.9 51.47,16.1 R35.2
N$23
  Bottom 0.203: U4.8 51.54,15.1 R36.2
N$24  (via drill 0.3)
  Top 0.203: v42.55,43.47 43.75,43.47 44.2,43.92 J9.1-1
  Top 1.016: J9.1 J9.1-1
  Bottom 0.203: R47.1 43.06,43.98 v42.55,43.47
N$25
  Top 0.203: J4.B5 63.68,35.84 63.48,36.04 63.48,38.14 65.25,39.91 R39.2
N$26
  Top 0.203: J4.A5 63.21,32.84 62.13,33.92 62.13,39.07 65.41,42.35 R40.2
N$27
  Bottom 0.203: R45.1 R44.1 27.92,14.79 Q5.1
N$28  (via drill 0.3)
  Top 0.254: v29.37,10.99 29.37,13.07 29.9,13.6 B1.2
  Bottom 0.203: v29.37,10.99 29.37,11.87 D1.+ 30.17,12.67 Q5.3
N$29  (via drill 0.3)
  Top 0.203: v33.26,13.62 34.67,13.62 B1.1
  Bottom 0.203: D1.- 32.29,11.94 32.57,12.22 R43.1 33.26,13.57 v33.26,13.62
N$30  (via drill 0.35)
  Top 0.203: J3.B5 63.38,15.23 63.1,15.51 v62.94,15.51
  Bottom 0.203: v62.94,15.51 62.2,15.51 R68.2
N$31
  Top 0.254: R52.1 28.16,29.87 27.65,29.36 27.65,28.31 27.83,28.13 R53.2 29.55,28.12 U6.5
N$32  (via drill 0.3)
  Top 0.203: J3.A5 63.42,12.23 v63.27,12.08
  Bottom 0.203: v63.27,12.08 63.15,12.2 62.35,12.2 R69.1
N$33
  Bottom 0.254: Q10.3 61.79,33.21 61.79,34.5 62.46,35.17 63.5,35.17 63.82,35.49 63.82,36.93 63.48,37.27 R25.2
N$34
  Bottom 0.254: Q10.1 63.13,30.5 62.88,30.25 62.88,29.47 R51.2
N$35
  Bottom 0.203: Q12.3 54.8,30.25 54.23,29.68 R22.1 53.33,29.68 52.76,30.25 Q11.1
N$36  (via drill 0.3)
  Top 0.203: v56.71,46.14 56.71,44.85 J8.1
  Top 1.016: J8.1 J8.1-1
  Bottom 0.203: R46.1 56.71,45.63 v56.71,46.14
N$39
  Bottom 0.381: R65.1 17.98,27.77 U7.2
N$40  (via drill 0.3)
  Top 0.203: D2.3 69.85,23.68 69.85,25.1 v69.39,25.56 | v49.6,21.06 49.36,20.82 49.36,17.41 48.91,16.96 46.72,16.96 46.2,16.44 46.2,7.83 v45.21,6.84
  Bottom 0.203: v69.39,25.56 69.39,26.62 67.48,28.53 60.26,28.53 56.35,24.62 56.35,23.17 R29.2 55.67,23.13 53.74,21.2 49.74,21.2 v49.6,21.06 | v45.21,6.84 45.21,6.55 45.47,6.29 46.05,6.29 R38.2
N$43  (via drill 0.3)
  Top 0.203: D2.4 68.32,23.02 66.78,21.48 v66.26,21.48 | v44.2,8.73 44.2,6.6 46.17,4.63 46.89,4.63 47.28,5.02 47.25,5.05 47.25,15.51 47.88,16.14 49.73,16.14 51.46,17.87 v51.67,17.87
  Bottom 0.203: R48.2 44.22,8.75 v44.2,8.73 | v51.67,17.87 52.18,18.38 63.13,18.38 64.24,19.49 64.24,20.19 63.96,20.47 R37.2 64.86,21.21 65.13,21.48 66.14,21.48 66.2,21.42 v66.26,21.48
N$46
  Bottom 0.381: R56.1 19.24,27.76 U7.3
N$47
  Bottom 0.381: R62.1 20.5,29.35 U7.4
N$49
  Bottom 0.508: R49.2 C8.1 23.56,24.91 C36.1 C35.1 20.61,23.47 19.91,23.47 19.23,22.8 U7.6
N$235
  Bottom 0.254: Q9.3 57.42,37.19 R24.1
NS_3V3
  Bottom 0.254: R19.1 13.05,30.26 Q2.3
NS_CTRL
  Bottom 0.254: R19.2 15.33,29.39 R55.1
  Bottom 0.381: R55.1 16.7,29.38 U7.1
OTG_D+  (via drill 0.3)
  Top 0.203: R42.2 65.32,40.73 63.12,38.53 63.12,35.19 63.47,34.84 J4.B6 66.12,34.84 v66.21,34.75 66.21,34.07 65.98,33.84 J4.A6
  Bottom 0.203: v66.21,34.75 67.52,34.75 P46.P$1
OTG_D-  (via drill 0.3)
  Top 0.203: R41.2 65.44,41.54 62.69,38.79 v62.69,34.42 | J4.B7 64.71,33.29 63.38,33.29 62.69,33.98 v62.69,34.42 | J4.A7 62.77,34.34 v62.69,34.42
  Bottom 0.203: v62.69,34.42 63.84,33.27 P45.P$1
ROUT+  (via drill 0.3)
  Top 0.61: v43.05,14.49 J2.1
  Top 0.635: v27.94,20.06 v27.94,20.05 31.4,20.05 38.39,13.06 41.69,13.06 43.05,14.42 v43.05,14.49
  Bottom 0.61: v43.05,14.49 43.05,15.74 P30.P$1
  Bottom 0.635: v27.94,20.06 27.92,20.04 C20.2 23.9,20.04 FB4.2
ROUT-  (via drill 0.3)
  Top 0.635: v29.32,22.83 29.87,22.83 38.65,14.05 40.44,14.05 v40.93,14.55 41.05,14.67 J2.2
  Bottom 0.635: P18.P$1 40.97,14.59 v40.93,14.55 | v29.32,22.83 29.3,22.81 C21.2 23.9,22.81 FB2.2
RTS
  Bottom 0.203: U10.1 54.49,10.48 R18.2 52.91,10.84 U4.6
RXD  (via drill 0.3)
  Top 0.203: v64.8,27.21 65.42,27.83 v70.02,27.83
  Bottom 0.203: R60.1 64.25,24.61 64.35,24.61 64.61,24.86 64.61,27.02 v64.8,27.21 | v70.02,27.83 70.56,27.29 70.56,25.06 71.06,24.56 J11.2
RXD0_H  (via drill 0.3)
  Top 0.203: v60.45,4.54 60.45,4.91 58.77,4.91 57.22,3.35 55.17,3.35 54.14,4.38 54.14,14.36 53.11,15.39 49.63,15.39 48.43,14.19 v48.43,13.53
  Top 0.635: J5.1 v60.45,4.54
  Bottom 0.203: R36.1 50.33,14.77 R34.1 49.34,14.77 48.87,14.31 Q4.3 48.43,14.29 v48.43,13.53
  Bottom 0.635: v60.45,4.54 60.45,6.24 P43.P$1
TFT_3V3  (via drill 0.3)
  Top 0.203: 42.31,24.58 42.31,25.91 42.19,26.03 v41.08,26.03
  Top 0.305: v33.59,25.43 32.68,26.34 v32.68,26.64 | v27.2,16.72 27.2,21.27 27.8,21.87 v27.8,23.75
  Top 0.381: v38.21,24.08 38.45,23.84 41.57,23.84 42.31,24.58
  Top 0.508: v46.19,30.52 v49.71,30.52
  Bottom 0.203: 42.25,26.03 C4.2 | v32.68,26.64 32.68,26.67 32.45,26.9 FPC1.2
  Bottom 0.305: v38.21,24.08 37.5,24.79 33.57,24.79 | 33.57,24.79 32.72,24.79 32.33,24.4 FPC1.7 28.45,24.4 v27.8,23.75 | v33.59,25.43 33.59,24.81 33.57,24.79 | R71.2 v27.2,16.72
  Bottom 0.381: FB3.2 C4.2 | v41.08,26.03 42.25,26.03
  Bottom 0.508: C4.2 C5.2 42.28,28.29 P7.P$1 42.72,30.93 45.78,30.93 v46.19,30.52 | v49.71,30.52 50.07,30.16 Q11.3
TFT_RST  (via drill 0.3)
  Top 0.203: v37.15,25.46 37.78,24.83 v41.09,24.83
  Bottom 0.203: R2.1 42.46,22.05 D12.+ 42.47,22.66 C6.2 42.4,23.49 41.66,23.49 41.34,23.81 41.34,24.58 v41.09,24.83 40.17,25.75 P8.P$1 | FPC1.6 32.25,24.9 33.36,26.01 36.6,26.01 v37.15,25.46
TXD  (via drill 0.3)
  Top 0.203: v65.64,27.21 70.36,27.21 v70.89,27.74
  Bottom 0.203: R59.1 64.06,23.6 64.35,23.6 64.99,24.24 64.99,26.56 v65.64,27.21 | v70.89,27.74 71.15,27.74 71.62,27.28 J11.1
TXD0_H  (via drill 0.3)
  Top 0.203: v48.43,15.16 49.02,15.75 53.39,15.75 54.54,14.6 54.54,4.51 55.24,3.81 56.8,3.81 v57.98,4.99
  Top 0.635: v57.98,4.99 57.98,8.12 J5.2
  Bottom 0.203: R35.1 49.51,16.08 R32.1 48.87,16.2 Q3.3 48.43,16.61 v48.43,15.16
  Bottom 0.635: P42.P$1 v57.99,5 v57.98,4.99
USB_D+  (via drill 0.3)
  Top 0.254: v63,14.71 63.48,14.23 J3.B6 65.86,14.23 66.08,14.01 66.08,13.34 65.97,13.23 J3.A6
  Bottom 0.203: P49.P$1 67.8,14.21 63.5,14.21 v63,14.71
  Bottom 0.254: v63,14.71 R27.2
USB_D-  (via drill 0.3)
  Top 0.203: v62.92,13.81 63.62,13.81 63.7,13.73 J3.A7
  Top 0.254: v62.92,13.81 62.92,12.95 63.14,12.73 J3.B7
  Bottom 0.203: v62.92,13.81 64.28,12.45 P50.P$1
  Bottom 0.254: R28.2 62.8,13.93 v62.92,13.81
VBAT  (via drill 0.3)
  Top 0.508: Q6.3 63.7,23.1 v64.25,22.55 | v67.1,25.72 67.2,25.82 v68.62,25.82 | 51.16,10.37 51.16,3.86 v51.17,3.85 | v49.06,10.37 51.16,10.37 | 51.16,10.37 51.16,10.61 52.38,11.84 J10.P$1
  Bottom 0.508: R5.1 50.29,9.55 49.92,9.91 C29.2 | C29.2 49.92,12.39 P52.P$1 | v51.17,3.85 52.75,2.27 60.82,2.27 66.19,7.64 67.12,7.64 68.22,8.74 68.22,9.64 68.84,10.26 69.68,10.26 71.54,12.12 71.54,14.69 70.47,15.76 69.48,15.76 68.24,17 68.24,18.51 68.62,18.89 v68.62,25.82 | v64.25,22.55 64.71,22.09 65.88,22.09 67.08,23.29 67.08,25.7 v67.1,25.72 | U5.3 v49.06,10.37 49.62,10.37 C29.2
VIN  (via drill 0.3)
  Top 0.5: D8.- 61.5,17.94 61.41,17.85 v61.41,17.82 | v66.19,20.6 66.24,20.6 66.42,20.77 69.84,20.77 v70.63,21.56
  Top 0.635: 57.28,24.26 v57.28,21.42 57.28,20.16 D6.- D9.- D8.- | Q6.2 65.36,25.04 63.49,25.04 63.12,25.41 58.43,25.41 57.28,24.26 | L3.2 38.68,28.61 v39.48,27.81 39.98,27.31 54.24,27.31 57.28,24.26 | U6.4 29.9,30.15 31.57,28.48 U6.1 34.17,28.48 C34.2 | C34.2 35.46,28.62 C30.2 36.21,28.61 L3.2 | C34.2 37.35,28.62 L3.2
  Bottom 0.203: R34.2 49.38,13.46 48.86,12.94 48.13,12.94 47.72,13.35 47.72,17.08 47.93,17.29 49.19,17.29 R32.2 49.4,18.64 51.04,20.29 56.98,20.29 57.28,20.59 v57.28,21.42
  Bottom 0.254: U14.2 57.34,22.38 C48.2
  Bottom 0.5: v61.41,17.82 63.41,17.82 v66.19,20.6 | v70.63,21.56 v70.63,21.57 J11.3
  Bottom 0.508: P54.P$1 39.48,31.03 v39.48,27.81
  Bottom 0.635: v57.28,21.42 C48.2

## Text on the board
tPlace: IO18-RX1 | IO17-TX1 | 3V3 | GND | OTG | ESP32 Display / 2.4 inch | (Advance_series) | SKU:DIS01624A | - | + | + | - | V1.2 | UART0 | GND | 3V3 | IO15_SDA | IO16_SCL | GND | 5V_IN | IO43-TX0 | IO44-RX0
bPlace: TXD | RXD | 5V | GND
bNames: FPC1